# Altium schematic sheet Discharge_circuit.SchDoc
size A4; SheetNumber: 5; SheetTotal: 6
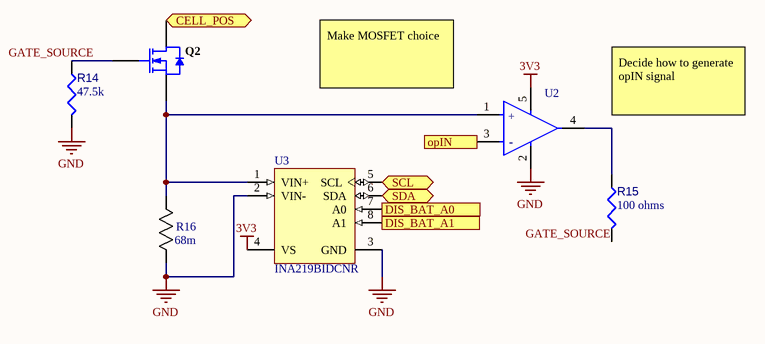
[diagram p0: Discharge_circuit.SchDoc]

## Parts
Q2  FQD13N06LTM  [FAIR-TO-252-3_V]  (value not drawn)
R14  value 47.5k  [RESC0402(1005)_L]  (hidden comment: Resistor 47K5 +/-1 % 0402 63 mW)
R15  value 100 ohms  [RESC0402(1005)_L]  (hidden comment: Resistor 100R +/-1 % 0402 63 mW)
R16  68m  [YAG_R2512_YAG]
U2  OPA391DCKT  [FP-DCK0005A-MFG]  (value not drawn)
U3  INA219BIDCNR  [DCN0008A_M]

## Ports
CELL_POS (bidir, see Main[1B]), DIS_BAT_A0 (in, see Main[1C]), DIS_BAT_A1 (in, see Main[1C]), opIN (in, see Main[1B]), SCL (bidir, see Main[1C]), SDA (bidir, see Main[1C])

## Nets
3V3: U2.5(V+) U3.4(VS)
GND: R14.2 R16.2 U2.2(V-) U3.2(VIN-) U3.3(GND)
CELL_POS: Q2.4(D) ; port CELL_POS
DIS_BAT_A0: U3.7(A0) ; port DIS_BAT_A0
DIS_BAT_A1: U3.8(A1) ; port DIS_BAT_A1
GATE_SOURCE: Q2.1(G) R14.1 R15.2
opIN: U2.3(-IN) ; port opIN
SCL: U3.5(SCL) ; port SCL
SDA: U3.6(SDA) ; port SDA
NetQ2_3: Q2.3(S) R16.1 U2.1(+IN) U3.1(VIN+)
NetR15_1: R15.1 U2.4(OUT)

## Notes on the sheet
- Make MOSFET choice
- Decide how to generate opIN signal
- (in symbol CMP-04895-000429-1) +; -

## Library data of the parts
Q2 = CMP-013-00023-3: N-Channel QFET(R) MOSFET, 11 A, 60 V, 115 mOhm, -55 to 150 degC, 3-Pin DPAK (TO-252), RoHS, Tape and Reel; Manufacturer: Fairchild; Power: 2.5W; Elements: 1; Typical Rise Time: 90ns; Package Version: Rev. 11, 05/2016; Input Capacitance: 350pF; Packaging: TapeandReel; Package Quantity: 2500; Mounting Technology: SM; Pins: 3; Max Operating Temperature: 150°C; Package Reference: TO-252; Case/Package: TO-252-3; Datasheet Version: Rev. 1.7, 07/2016; RoHS Compliant: True; Rds On Max: 115mohm; Package Description: 3-Pin Transistor Outline, Body 6.54 x 6.095 mm, Pitch 2.28 mm; Datasheet URL: https://www.fairchildsemi.com/datasheets/FQ/FQD13N06L.pdf; Min Operating Temperature: -55°C
R14 = CMP-009-00137-3: Chip Resistor, 47,5 kOhms, +/-1 %, 63 mW, -55 to 155 degC, 0402; Power: 63mW; Tolerance: 1%; Pins: 2; Case/Package: 0402; Min Operating Temperature: -55°C; Max Operating Temperature: 155°C
R15 = CMP-009-00167-3: Chip Resistor, 100 Ohms, +/-1 %, 63 mW, -55 to 155 degC, 0402; Power: 63mW; Tolerance: 1%; Min Operating Temperature: -55°C; Case/Package: 0402; Pins: 2; Max Operating Temperature: 155°C
R16 = CMP-009-00177-1: RL2512FK-070R068L; Manufacturer_Name: Yageo; Source: RL2512FK-070R068L.SchLib; Pins: 2; Design Item ID: RL2512FK-070R068L; Copyright: Copyright (C) 2026 Ultra Librarian. All rights reserved.; Manufacturer_Part_Number: RL2512FK-070R068L; Component Type: Standard
U2 = CMP-04895-000429-1: IC OPAMP GP 1 CIRCUIT SC70-5
U3 = CMP-0704-00043-2: Zero-Drift, Bi-Directional Current / Power Monitor, 3 to 5.5 V, -40 to 125 degC, 8-pin SOP (DCN8), Green (RoHS & no Sb/Br); Manufacturer: Texas Instruments; Gain(V/V): 1, 0.5, 0.25, 0.125; Vs(Min)(V): 3; Vs(Max)(V): 5.5; SubFamily: Current Shunt Monitor; Rating: Catalog; Small-Signal Bandwidth(Typ)(MHz): 0.011; Common Mode Range(Min)(V): 0; Quiescent Current (+/-)(Typ)(mA): 0.7; Input Offset (+/-)(Max)(uV): 50; Common Mode Range(Max)(V): 26; CMRR(Min)(dB): 100; DatasheetVersion: SBOS448F; ComponentLink2Description: Datasheet; PartNumber: INA219BIDCNR; ComponentLink3URL: http://www.ti.com/lit/ml/mpds099c/mpds099c.pdf; ComponentLink2URL: http://www.ti.com/general/docs/lit/getliterature.tsp?genericPartNumber=INA219&fileType=pdf; PackageDescription: 8-Pin Plastic Small Outline, Body 1.6 x 2.9 mm, Pitch 0.65 mm; PackageReference: DCN0008A; PackageVersion: 4202106/D, 11/2009; ComponentLink1Description: Manufacturer URL; ComponentLink3Description: Package Specification; Eco-Plan: Green (RoHS & no Sb/Br); ComponentLink1URL: http://www.ti.com/; Code_JEDEC: MO-178; Mounting Technology: Surface Mount